# Altium project Pong.PrjPcb (part 1 of 2)
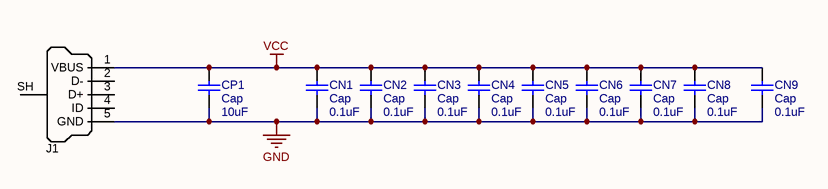
[diagram p0: POWER.SchDoc]
17 sheets, 105 parts. Net scope: flat (ports and power ports of the same name join across sheets).
Board files: PONG.PcbDoc, PONG_2.PcbDoc, PONG_3.PcbDoc
Sheets:
  POWER.SchDoc
  CLK.SchDoc
  HSYNC.SchDoc
  VSYNC.SchDoc
  SYNC-VideoSum.SchDoc
  Paddle_1.SchDoc
  Paddle_2.SchDoc
  Net.SchDoc
  HorizBallCounter.SchDoc
  HorizBallControl.SchDoc
  VertBallCounter.SchDoc
  VertBallControl.SchDoc
  ScoreCount.SchDoc
  ScoreDisplay_1.SchDoc
  ScoreDisplay_2.SchDoc
  GameControl.SchDoc
  Sound.SchDoc

## Sheet POWER.SchDoc: POWER
size A4

### Parts
CN1  Cap  value 0.1uF  [CAPR10.16-11.5x3.6]
CN2  Cap  value 0.1uF  [CAPR10.16-11.5x3.6]
CN3  Cap  value 0.1uF  [CAPR10.16-11.5x3.6]
CN4  Cap  value 0.1uF  [CAPR10.16-11.5x3.6]
CN5  Cap  value 0.1uF  [CAPR10.16-11.5x3.6]
CN6  Cap  value 0.1uF  [CAPR10.16-11.5x3.6]
CN7  Cap  value 0.1uF  [CAPR10.16-11.5x3.6]
CN8  Cap  value 0.1uF  [CAPR10.16-11.5x3.6]
CN9  Cap  value 0.1uF  [CAPR10.16-11.5x3.6]
CP1  Cap  value 10uF  [CAPE3.5mm]
J1  USB Micro Type B (recommended if hand soldering)  [USB Micro B SMD]  (value not drawn)

### Nets
GND: CN1.1 CN2.1 CN3.1 CN4.1 CN5.1 CN6.1 CN7.1 CN8.1 CN9.1 CP1.2 J1.5(GND)
VCC: CN1.2 CN2.2 CN3.2 CN4.2 CN5.2 CN6.2 CN7.2 CN8.2 CN9.2 CP1.1 J1.1(VBUS)

Not connected (* = marked no-connect by the designer): J1 2(D-) 3(D+) 4(ID) SH(Shell)

### Notes on the sheet
- Text
- Page
- PONG

### Library data of the parts
CN1-CN9 CP1 = Cap: Capacitor; Published: 8-Jun-2000; LatestRevisionDate: 17-Jul-2002; LatestRevisionNote: Re-released for DXP Platform.; PackageReference: RAD-0.3; Publisher: Altium Limited; PackageDescription: Radial Cap, Thru-Hole; 2 Leads; 0.3 in Pin Spacing
J1 = USB_Micro_TypeB_FCI: Connector SMD-THD USB Micro Type B middle mount; Manufacturer 1: FCI; Manufacturer Part Number 1: 10103593-0001LF; SCDType: undef; Package / Case: SMD/THD mid-mount; Supplier 1: Digi-Key; Supplier Part Number 1: 609-4049-1-ND

## Sheet CLK.SchDoc: CLK
size A4; SheetNumber: 1
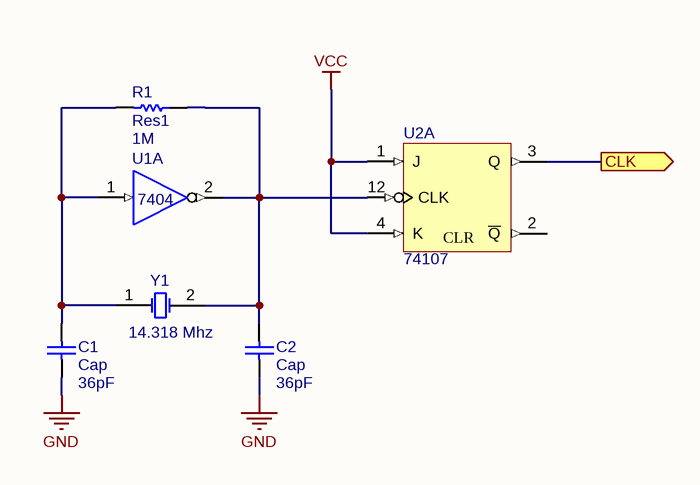
[diagram p1: CLK.SchDoc]

### Parts
C1  Cap  value 36pF  [CAPR10.16-11.5x3.6]
C2  Cap  value 36pF  [CAPR10.16-11.5x3.6]
R1  Res1  value 1M  [AXIAL-0.4]
U1  7404  [N014]  (part A of 6)
U2  74107  [N014D]  (part A of 2)
Y1  14.318 Mhz  [HC-49U]

### Ports
CLK

### Nets
GND: C1.1 C2.1 U1.7(GND) U2.7(GND)
VCC: U1.14(VCC) U2.1(J) U2.4(K) U2.13(CLR) U2.14(VCC)
CLK: U2.3(Q) ; port CLK
NetC1_2: C1.2 R1.2 U1.1(A) Y1.1(OSC1)
NetC2_2: C2.2 R1.1 U1.2(Y) U2.12(CLK) Y1.2(OSC2)

Not connected (* = marked no-connect by the designer): U2 2(~{Q})

### Notes on the sheet
- Text
- Page
- PONG

### Library data of the parts
C1 C2 = Cap: Capacitor; Published: 8-Jun-2000; LatestRevisionDate: 17-Jul-2002; LatestRevisionNote: Re-released for DXP Platform.; PackageReference: RAD-0.3; Publisher: Altium Limited; PackageDescription: Radial Cap, Thru-Hole; 2 Leads; 0.3 in Pin Spacing
R1 = Res1: Resistor; Published: 8-Jun-2000; LatestRevisionDate: 17-Jul-2002; LatestRevisionNote: Re-released for DXP Platform.; PackageReference: AXIAL-0.3; Publisher: Altium Limited; PackageDescription: Axial Device, Thru-Hole; 2 Leads; 0.3 in Pin Spacing
U1 = SN74LS04N: Hex Inverter; Published: 8-Jun-2000; LatestRevisionDate: 04-Mar-2005; LatestRevisionNote: Stylized 3D Model Added.; DatasheetVersion: Mar-1988; PackageVersion: Oct-1995; PackageReference: N014; Publisher: Altium Limited; PackageDescription: DIP; 14 Leads; Row Spacing 7.62 mm; Pitch 2.54 mm; ComponentLink1Description: Manufacturer Link; ComponentLink1URL: http://www.ti.com/; ComponentLink2Description: Datasheet; ComponentLink2URL: http://www-s.ti.com/sc/ds/sn74ls04.pdf
U2 = SN74HC107N: Dual J-K Negative-Edge-Triggered Flip-Flop with Clear; Published: 8-Jun-2000; LatestRevisionDate: 04-Mar-2005; LatestRevisionNote: Stylized 3D Model Added.; DatasheetVersion: Jun-1989; PackageVersion: Oct-1995; PackageReference: N014D; Publisher: Altium Limited; PackageDescription: DIP; 14 Leads; Row Spacing 7.62 mm; Pitch 2.54 mm; ComponentLink1Description: Manufacturer Link; ComponentLink1URL: http://www.ti.com/
Y1 = XTAL: Crystal Oscillator; Published: 8-Jun-2000; LatestRevisionDate: 17-Jul-2002; LatestRevisionNote: Re-released for DXP Platform.; PackageReference: R38; Publisher: Altium Limited; PackageDescription: Crystal, Thru-Hole; 2 Leads; Body 3.1 x 8.2 mm (Dia.xH)

## Sheet HSYNC.SchDoc: HSYNC
size A4; SheetNumber: 2
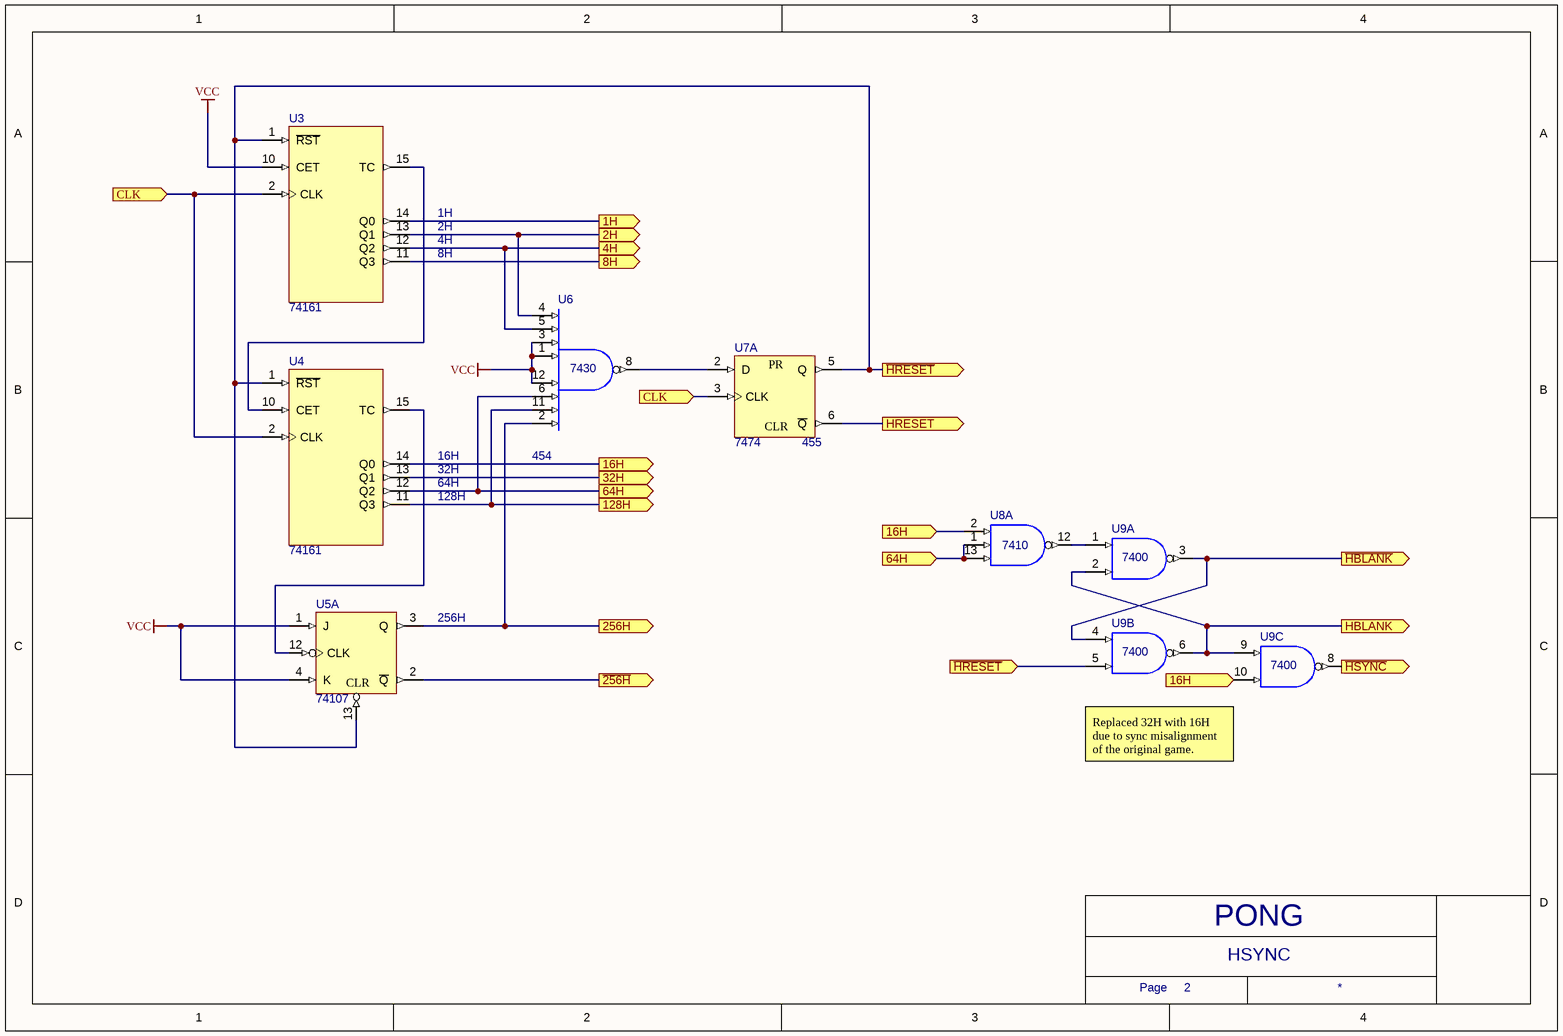
[diagram p2: HSYNC.SchDoc]

### Parts
U3  74161  [N016]
U4  74161  [N016]
U5  74107  [N014]  (part A of 2)
U6  7430  [N014]
U7  7474  [N014D]  (part A of 2)
U8  7410  [N014]  (part A of 3)
U9  7400  [N014]  (parts A,B,C of 4)

### Ports
1H, 2H, 4H, 8H, 16H, 32H, 64H, 128H, 256H, CLK, HBLANK, HRESET, ~{256H}, ~{HBLANK}, ~{HRESET}, ~{HSYNC}

### Nets
GND: U3.8(GND) U4.8(GND) U5.7(GND) U6.7(GND) U7.7(GND) U8.7(GND) U9.7(GND)
VCC: U3.3(P0) U3.4(P1) U3.5(P2) U3.6(P3) U3.7(CEP) U3.9(~{PE}) U3.10(CET) U3.16(VCC) U4.3(P0) U4.4(P1) U4.5(P2) U4.6(P3) U4.7(CEP) U4.9(~{PE}) U4.16(VCC) U5.1(J) U5.4(K) U5.14(VCC) U6.1(A) U6.3(C) U6.12(H) U6.14(VCC) U7.1(CLR) U7.4(PR) U7.14(VCC) U8.14(VCC) U9.14(VCC)
1H: U3.14(Q0) ; port 1H
2H: U3.13(Q1) U6.4(D) ; port 2H
4H: U3.12(Q2) U6.5(E) ; port 4H
8H: U3.11(Q3) ; port 8H
16H: U4.14(Q0) U8.2(B) U9.10(B) ; port 16H
32H: U4.13(Q1) ; port 32H
64H: U4.12(Q2) U6.6(F) U8.1(A) U8.13(C) ; port 64H
128H: U4.11(Q3) U6.11(G) ; port 128H
256H: U5.3(Q) U6.2(B) ; port 256H
~{256H}: U5.2(~{Q}) ; port ~{256H}
~{HBLANK}: U9.3(Y) U9.4(A) ; port ~{HBLANK}
~{HRESET}: U3.1(~{RST}) U4.1(~{RST}) U5.13(CLR) U7.5(Q) U9.5(B) ; port ~{HRESET}
~{HSYNC}: U9.8(Y) ; port ~{HSYNC}
CLK: U3.2(CLK) U4.2(CLK) U7.3(CLK) ; port CLK
HBLANK: U9.2(B) U9.6(Y) U9.9(A) ; port HBLANK
HRESET: U7.6(~{Q}) ; port HRESET
NetU3_15: U3.15(TC) U4.10(CET)
NetU4_15: U4.15(TC) U5.12(CLK)
NetU6_8: U6.8(Y) U7.2(D)
NetU8_12: U8.12(Y) U9.1(A)

### Notes on the sheet
- 1H
- 2H
- 4H
- 8H
- (near U7) 455
- 16H
- 32H
- 64H
- 128H
- (near U6) 454
- (near U5) 256H
- (near U9) Replaced 32H with 16H due to sync misalignment of the original game.
- Text
- Page
- PONG

### Library data of the parts
U3 U4 = SN74LS161AN: Synchronous 4-Bit Counter; Published: 8-Jun-2000; LatestRevisionDate: 04-Mar-2005; LatestRevisionNote: Stylized 3D Model Added.; DatasheetVersion: Mar-1988; PackageVersion: Oct-1995; PackageReference: N016; Publisher: Altium Limited; PackageDescription: DIP; 16 Leads; Row Spacing 7.62 mm; Pitch 2.54 mm; Code_JEDEC: MS-001-BB; ComponentLink1Description: Manufacturer Link; ComponentLink1URL: http://www.ti.com/; ComponentLink2Description: Datasheet; ComponentLink2URL: http://www-s.ti.com/sc/ds/sn74ls161a.pdf; ComponentLink3Description: URL Link1; ComponentLink3URL: http://focus.ti.com/docs/prod/folders/print/sn74ls161a.html
U5 = SN74LS107AN: Dual J-K Flip-Flop with Clear; Published: 8-Jun-2000; LatestRevisionDate: 04-Mar-2005; LatestRevisionNote: Stylized 3D Model Added.; DatasheetVersion: Mar-1988; PackageVersion: Oct-1995; PackageReference: N014; Publisher: Altium Limited; PackageDescription: DIP; 14 Leads; Row Spacing 7.62 mm; Pitch 2.54 mm; ComponentLink1Description: Manufacturer Link; ComponentLink1URL: http://www.ti.com/; ComponentLink2Description: Datasheet; ComponentLink2URL: http://www-s.ti.com/sc/ds/sn74ls107a.pdf
U6 = SN74LS30N: 8-Input Positive-NAND Gate; Note: Pins 9, 10  and 13 are NC & not drawn.; Published: 8-Jun-2000; LatestRevisionDate: 04-Mar-2005; LatestRevisionNote: Stylized 3D Model Added.; DatasheetVersion: Mar-1988; PackageVersion: Oct-1995; PackageReference: N014; Publisher: Altium Limited; PackageDescription: DIP; 14 Leads; Row Spacing 7.62 mm; Pitch 2.54 mm; ComponentLink1Description: Manufacturer Link; ComponentLink1URL: http://www.ti.com/; ComponentLink2Description: Datasheet; ComponentLink2URL: http://www-s.ti.com/sc/ds/sn74s30.pdf
U7 = SN74LS74AN: Dual D-Type Positive-Edge-Triggered Flip-Flop with Preset and Clear; Published: 8-Jun-2000; LatestRevisionDate: 04-Mar-2005; LatestRevisionNote: Stylized 3D Model Added.; DatasheetVersion: Mar-1988; PackageVersion: Oct-1995; PackageReference: N014D; Publisher: Altium Limited; PackageDescription: DIP; 14 Leads; Row Spacing 7.62 mm; Pitch 2.54 mm; ComponentLink1Description: Manufacturer Link; ComponentLink1URL: http://www.ti.com/; ComponentLink2Description: Datasheet; ComponentLink2URL: http://www-s.ti.com/sc/ds/sn74ls74a.pdf
U8 = SN74LS10N: Triple 3-Input Positive-NAND Gate; Published: 8-Jun-2000; LatestRevisionDate: 04-Mar-2005; LatestRevisionNote: Stylized 3D Model Added.; DatasheetVersion: Mar-1988; PackageVersion: Oct-1995; PackageReference: N014; Publisher: Altium Limited; PackageDescription: DIP; 14 Leads; Row Spacing 7.62 mm; Pitch 2.54 mm; ComponentLink1Description: Manufacturer Link; ComponentLink1URL: http://www.ti.com/; ComponentLink2Description: Datasheet; ComponentLink2URL: http://www-s.ti.com/sc/ds/sn74ls10.pdf
U9 = SN74LS00N: Quadruple 2-Input Positive-NAND Gate; Published: 8-Jun-2000; LatestRevisionDate: 04-Mar-2005; LatestRevisionNote: Stylized 3D Model Added.; DatasheetVersion: Mar-1988; PackageVersion: Oct-1995; PackageReference: N014; Publisher: Altium Limited; PackageDescription: DIP; 14 Leads; Row Spacing 7.62 mm; Pitch 2.54 mm; ComponentLink1Description: Manufacturer Link; ComponentLink1URL: http://www.ti.com/; ComponentLink2Description: Datasheet; ComponentLink2URL: http://www-s.ti.com/sc/ds/sn74ls00.pdf

## Sheet VSYNC.SchDoc: VSYNC
size A4; SheetNumber: 3
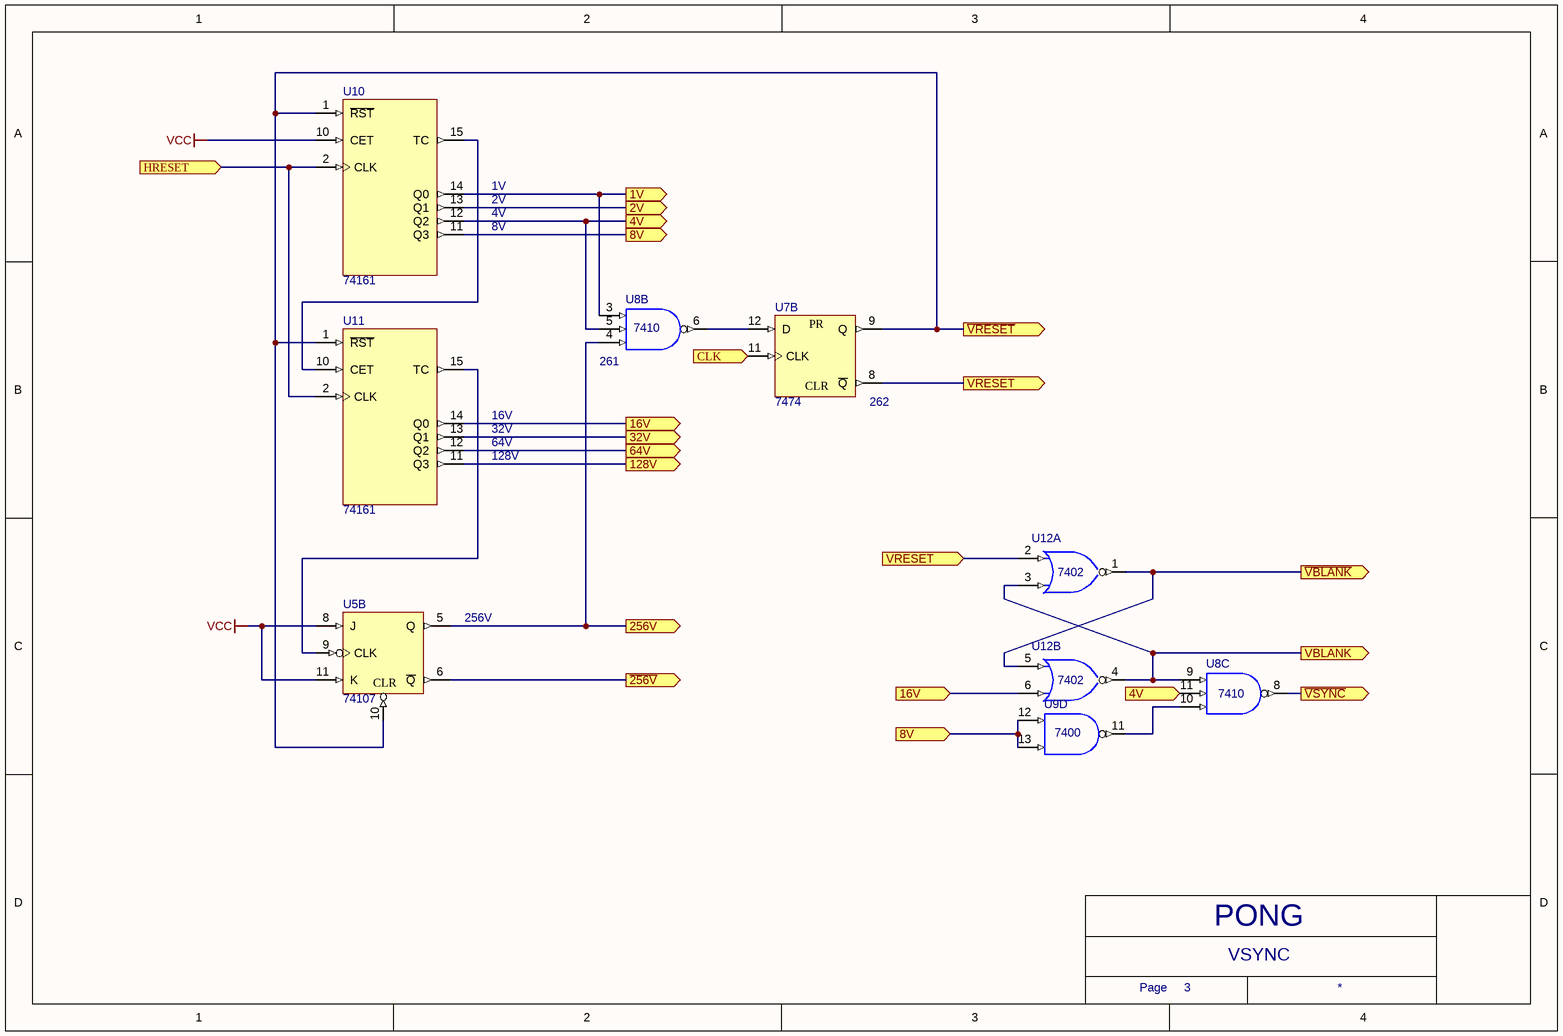
[diagram p3: VSYNC.SchDoc]

### Parts
U5  74107  [N014]  (part B of 2)
U7  7474  [N014D]  (part B of 2)
U8  7410  [N014]  (parts B,C of 3)
U9  7400  [N014]  (part D of 4)
U10  74161  [N016]
U11  74161  [N016]
U12  7402  [N014]  (parts A,B of 4)

### Ports
1V, 2V, 4V, 8V, 16V, 32V, 64V, 128V, 256V, CLK, HRESET, VBLANK, VRESET, ~{256V}, ~{VBLANK}, ~{VRESET}, ~{VSYNC}

### Nets
GND: U5.7(GND) U7.7(GND) U8.7(GND) U9.7(GND) U10.8(GND) U11.8(GND) U12.7(GND)
VCC: U5.8(J) U5.11(K) U5.14(VCC) U7.10(PR) U7.13(CLR) U7.14(VCC) U8.14(VCC) U9.14(VCC) U10.3(P0) U10.4(P1) U10.5(P2) U10.6(P3) U10.7(CEP) U10.9(~{PE}) U10.10(CET) U10.16(VCC) U11.3(P0) U11.4(P1) U11.5(P2) U11.6(P3) U11.7(CEP) U11.9(~{PE}) U11.16(VCC) U12.14(VCC)
1V: U8.3(A) U10.14(Q0) ; port 1V
2V: U10.13(Q1) ; port 2V
4V: U8.5(C) U8.11(C) U10.12(Q2) ; port 4V
8V: U9.12(A) U9.13(B) U10.11(Q3) ; port 8V
16V: U11.14(Q0) U12.6(B) ; port 16V
32V: U11.13(Q1) ; port 32V
64V: U11.12(Q2) ; port 64V
128V: U11.11(Q3) ; port 128V
256V: U5.5(Q) U8.4(B) ; port 256V
~{256V}: U5.6(~{Q}) ; port ~{256V}
~{VBLANK}: U12.1(Y) U12.5(A) ; port ~{VBLANK}
~{VRESET}: U5.10(CLR) U7.9(Q) U10.1(~{RST}) U11.1(~{RST}) ; port ~{VRESET}
~{VSYNC}: U8.8(Y) ; port ~{VSYNC}
CLK: U7.11(CLK) ; port CLK
HRESET: U10.2(CLK) U11.2(CLK) ; port HRESET
VBLANK: U8.9(A) U12.3(B) U12.4(Y) ; port VBLANK
VRESET: U7.8(~{Q}) U12.2(A) ; port VRESET
NetU5_9: U5.9(CLK) U11.15(TC)
NetU7_12: U7.12(D) U8.6(Y)
NetU8_10: U8.10(B) U9.11(Y)
NetU10_15: U10.15(TC) U11.10(CET)

### Notes on the sheet
- 1V
- 2V
- 4V
- 8V
- (near U8) 261
- 16V
- 32V
- 64V
- (near U7) 262
- 128V
- (near U5) 256V
- Text
- Page
- PONG

### Library data of the parts
U5 = SN74LS107AN: Dual J-K Flip-Flop with Clear; Published: 8-Jun-2000; LatestRevisionDate: 04-Mar-2005; LatestRevisionNote: Stylized 3D Model Added.; DatasheetVersion: Mar-1988; PackageVersion: Oct-1995; PackageReference: N014; Publisher: Altium Limited; PackageDescription: DIP; 14 Leads; Row Spacing 7.62 mm; Pitch 2.54 mm; ComponentLink1Description: Manufacturer Link; ComponentLink1URL: http://www.ti.com/; ComponentLink2Description: Datasheet; ComponentLink2URL: http://www-s.ti.com/sc/ds/sn74ls107a.pdf
U7 = SN74LS74AN: as U7 on sheet HSYNC; Published: 8-Jun-2000; LatestRevisionDate: 04-Mar-2005; LatestRevisionNote: Stylized 3D Model Added.; DatasheetVersion: Mar-1988; PackageVersion: Oct-1995; PackageReference: N014D; Publisher: Altium Limited; PackageDescription: DIP; 14 Leads; Row Spacing 7.62 mm; Pitch 2.54 mm; ComponentLink1Description: Manufacturer Link; ComponentLink1URL: http://www.ti.com/; ComponentLink2Description: Datasheet; ComponentLink2URL: http://www-s.ti.com/sc/ds/sn74ls74a.pdf
U8 = SN74LS10N: Triple 3-Input Positive-NAND Gate; Published: 8-Jun-2000; LatestRevisionDate: 04-Mar-2005; LatestRevisionNote: Stylized 3D Model Added.; DatasheetVersion: Mar-1988; PackageVersion: Oct-1995; PackageReference: N014; Publisher: Altium Limited; PackageDescription: DIP; 14 Leads; Row Spacing 7.62 mm; Pitch 2.54 mm; ComponentLink1Description: Manufacturer Link; ComponentLink1URL: http://www.ti.com/; ComponentLink2Description: Datasheet; ComponentLink2URL: http://www-s.ti.com/sc/ds/sn74ls10.pdf
U9 = SN74LS00N: Quadruple 2-Input Positive-NAND Gate; Published: 8-Jun-2000; LatestRevisionDate: 04-Mar-2005; LatestRevisionNote: Stylized 3D Model Added.; DatasheetVersion: Mar-1988; PackageVersion: Oct-1995; PackageReference: N014; Publisher: Altium Limited; PackageDescription: DIP; 14 Leads; Row Spacing 7.62 mm; Pitch 2.54 mm; ComponentLink1Description: Manufacturer Link; ComponentLink1URL: http://www.ti.com/; ComponentLink2Description: Datasheet; ComponentLink2URL: http://www-s.ti.com/sc/ds/sn74ls00.pdf
U10 U11 = SN74LS161AN: Synchronous 4-Bit Counter; Published: 8-Jun-2000; LatestRevisionDate: 04-Mar-2005; LatestRevisionNote: Stylized 3D Model Added.; DatasheetVersion: Mar-1988; PackageVersion: Oct-1995; PackageReference: N016; Publisher: Altium Limited; PackageDescription: DIP; 16 Leads; Row Spacing 7.62 mm; Pitch 2.54 mm; Code_JEDEC: MS-001-BB; ComponentLink1Description: Manufacturer Link; ComponentLink1URL: http://www.ti.com/; ComponentLink2Description: Datasheet; ComponentLink2URL: http://www-s.ti.com/sc/ds/sn74ls161a.pdf; ComponentLink3Description: URL Link1; ComponentLink3URL: http://focus.ti.com/docs/prod/folders/print/sn74ls161a.html
U12 = SN74LS02N: Quadruple 2-Input Positive-NOR Gate; Published: 8-Jun-2000; LatestRevisionDate: 04-Mar-2005; LatestRevisionNote: Stylized 3D Model Added.; DatasheetVersion: Mar-1988; PackageVersion: Oct-1995; PackageReference: N014; Publisher: Altium Limited; PackageDescription: DIP; 14 Leads; Row Spacing 7.62 mm; Pitch 2.54 mm; ComponentLink1Description: Manufacturer Link; ComponentLink1URL: http://www.ti.com/; ComponentLink2Description: Datasheet; ComponentLink2URL: http://www-s.ti.com/sc/ds/sn54s02.pdf

## Sheet SYNC-VideoSum.SchDoc: SYNC/Video Sum
size A4
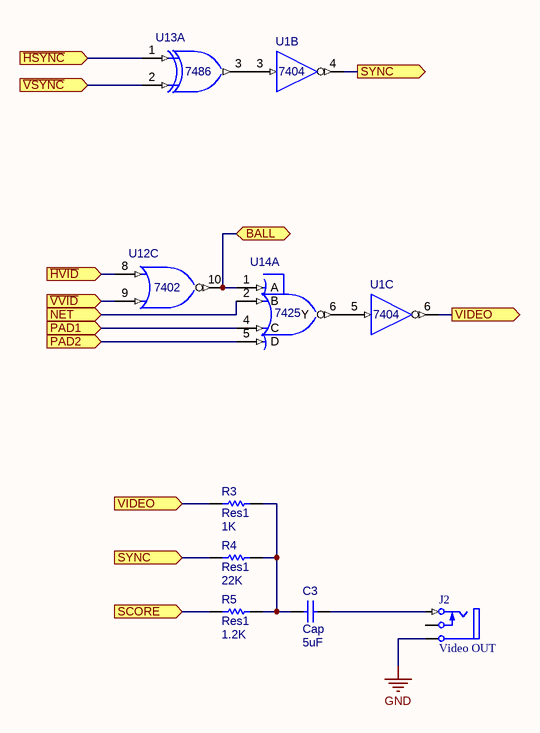
[diagram p4: SYNC-VideoSum.SchDoc]

### Parts
C3  Cap  value 5uF  [CAPR10.16-11.5x3.6]
J2  Video OUT  [RCA 2]
R3  Res1  value 1K  [AXIAL-0.4]
R4  Res1  value 22K  [AXIAL-0.4]
R5  Res1  value 1.2K  [AXIAL-0.4]
U1  7404  [N014]  (parts B,C of 6)
U12  7402  [N014]  (part C of 4)
U13  7486  [N014]  (part A of 4)
U14  7425  [N014]  (part A of 2)

### Ports
BALL, NET, PAD1, PAD2, SCORE, SYNC, VIDEO, ~{HSYNC}, ~{HVID}, ~{VSYNC}, ~{VVID}

### Nets
GND: J2.1(S) U1.7(GND) U12.7(GND) U13.7(GND) U14.7(GND)
VCC: U1.14(VCC) U12.14(VCC) U13.14(VCC) U14.3(G) U14.14(VCC)
~{HSYNC}: U13.1(A) ; port ~{HSYNC}
~{HVID}: U12.8(A) ; port ~{HVID}
~{VSYNC}: U13.2(B) ; port ~{VSYNC}
~{VVID}: U12.9(B) ; port ~{VVID}
BALL: U12.10(Y) U14.1(A) ; port BALL
NET: U14.2(B) ; port NET
PAD1: U14.4(C) ; port PAD1
PAD2: U14.5(D) ; port PAD2
SCORE: R5.1 ; port SCORE
SYNC: R4.1 U1.4(Y) ; port SYNC
VIDEO: R3.1 U1.6(Y) ; port VIDEO
NetC3_1: C3.1 R3.2 R4.2 R5.2
NetC3_2: C3.2 J2.2(T)
NetU1_3: U1.3(A) U13.3(Y)
NetU1_5: U1.5(A) U14.6(Y)

Not connected (* = marked no-connect by the designer): J2 3(TN)

### Notes on the sheet
- Text
- Page
- PONG

### Library data of the parts
C3 = Cap: Capacitor; Published: 8-Jun-2000; LatestRevisionDate: 17-Jul-2002; LatestRevisionNote: Re-released for DXP Platform.; PackageReference: RAD-0.3; Publisher: Altium Limited; PackageDescription: Radial Cap, Thru-Hole; 2 Leads; 0.3 in Pin Spacing
J2 = Phonejack2 TN: Jack Socket, 1/4" [6.5mm], Thru-Hole, Vertical, 2-Conductor with Tip closed; PackageDocument: 2003; PCB_Layout: Complies with manufacturer's recommendation.; DrillAndSlotSize: Corresponds to nominal value.; LatestRevisionDate: 15-Jul-2004; LatestRevisionNote: Component Replaced & renamed from "Phonejack".; DatasheetDocument: 2003; PackageReference: S1VS_SNB; Publisher: Altium Limited; ComponentLink1Description: Manufacturer Link; ComponentLink1URL: http://www.cliffuk.co.uk/
R3-R5 = Res1: Resistor; Published: 8-Jun-2000; LatestRevisionDate: 17-Jul-2002; LatestRevisionNote: Re-released for DXP Platform.; PackageReference: AXIAL-0.3; Publisher: Altium Limited; PackageDescription: Axial Device, Thru-Hole; 2 Leads; 0.3 in Pin Spacing
U1 = SN74LS04N: Hex Inverter; Published: 8-Jun-2000; LatestRevisionDate: 04-Mar-2005; LatestRevisionNote: Stylized 3D Model Added.; DatasheetVersion: Mar-1988; PackageVersion: Oct-1995; PackageReference: N014; Publisher: Altium Limited; PackageDescription: DIP; 14 Leads; Row Spacing 7.62 mm; Pitch 2.54 mm; ComponentLink1Description: Manufacturer Link; ComponentLink1URL: http://www.ti.com/; ComponentLink2Description: Datasheet; ComponentLink2URL: http://www-s.ti.com/sc/ds/sn74ls04.pdf
U12 = SN74LS02N: Quadruple 2-Input Positive-NOR Gate; Published: 8-Jun-2000; LatestRevisionDate: 04-Mar-2005; LatestRevisionNote: Stylized 3D Model Added.; DatasheetVersion: Mar-1988; PackageVersion: Oct-1995; PackageReference: N014; Publisher: Altium Limited; PackageDescription: DIP; 14 Leads; Row Spacing 7.62 mm; Pitch 2.54 mm; ComponentLink1Description: Manufacturer Link; ComponentLink1URL: http://www.ti.com/; ComponentLink2Description: Datasheet; ComponentLink2URL: http://www-s.ti.com/sc/ds/sn54s02.pdf
U13 = SN74LS86AN: Quadruple 2-Input Exclusive-OR Gate; Published: 8-Jun-2000; LatestRevisionDate: 04-Mar-2005; LatestRevisionNote: Stylized 3D Model Added.; DatasheetVersion: Mar-1988; PackageVersion: Oct-1995; PackageReference: N014; Publisher: Altium Limited; PackageDescription: DIP; 14 Leads; Row Spacing 7.62 mm; Pitch 2.54 mm; ComponentLink1Description: Manufacturer Link; ComponentLink1URL: http://www.ti.com/; ComponentLink2Description: Datasheet; ComponentLink2URL: http://www-s.ti.com/sc/ds/sn74ls86a.pdf
U14 = SN7425N: Dual 4-Input NOR Gate with Strobe; Published: 8-Jun-2000; LatestRevisionDate: 04-Mar-2005; LatestRevisionNote: Stylized 3D Model Added.; DatasheetVersion: Mar-1988; PackageVersion: Oct-1995; PackageReference: N014; Publisher: Altium Limited; PackageDescription: DIP; 14 Leads; Row Spacing 7.62 mm; Pitch 2.54 mm; ComponentLink1Description: Manufacturer Link; ComponentLink1URL: http://www.ti.com/; ComponentLink2Description: Datasheet; ComponentLink2URL: http://www-s.ti.com/sc/ds/sn5425.pdf; ComponentLink3Description: Packaging Specification; ComponentLink3URL: http://focus.ti.com/lit/ml/mpdi002c/mpdi002c.pdf

## Sheet Paddle_1.SchDoc: Paddle 1
size A4
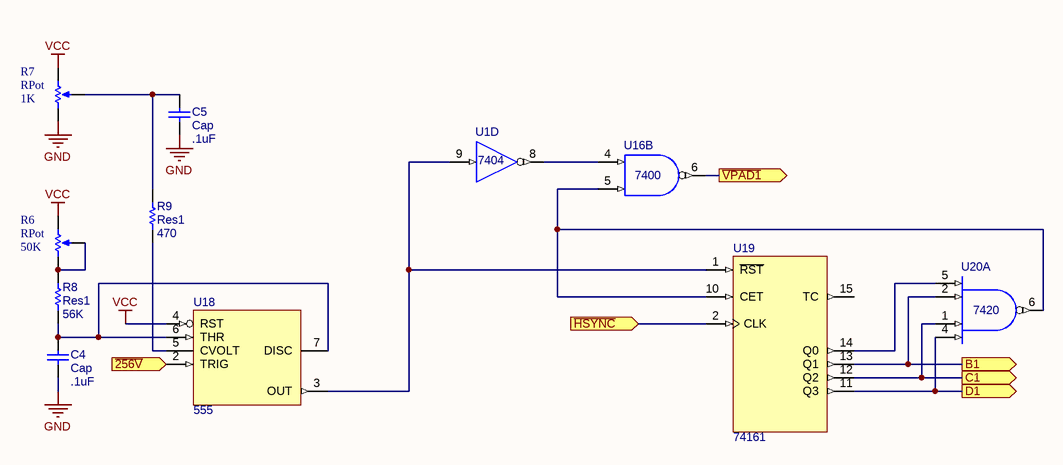
[diagram p5: Paddle_1.SchDoc]

### Parts
C4  Cap  value .1uF  [CAPR10.16-11.5x3.6]
C5  Cap  value .1uF  [CAPR10.16-11.5x3.6]
R6  RPot  value 50K  [TRIMPOT_THT_PV36X]
R7  RPot  value 1K  [VR5]
R8  Res1  value 56K  [AXIAL-0.4]
R9  Res1  value 470  [AXIAL-0.4]
U1  7404  [N014]  (part D of 6)
U16  7400  [N014]  (part B of 4)
U18  555  [P008]
U19  74161  [N016]
U20  7420  [N014]  (part A of 2)

### Ports
B1, C1, D1, ~{256V}, ~{HSYNC}, ~{VPAD1}

### Nets
GND: C4.1 C5.1 R7.1(TOP) U1.7(GND) U16.7(GND) U18.1(GND) U19.8(GND) U20.7(GND)
VCC: R6.CW(BOT) R7.2(BOT) U1.14(VCC) U16.14(VCC) U18.4(RST) U18.8(VCC) U19.3(P0) U19.4(P1) U19.5(P2) U19.6(P3) U19.7(CEP) U19.9(~{PE}) U19.16(VCC) U20.14(VCC)
~{256V}: U18.2(TRIG) ; port ~{256V}
~{HSYNC}: U19.2(CLK) ; port ~{HSYNC}
~{VPAD1}: U16.6(Y) ; port ~{VPAD1}
B1: U19.13(Q1) U20.2(B) ; port B1
C1: U19.12(Q2) U20.1(A) ; port C1
D1: U19.11(Q3) U20.4(C) ; port D1
NetC4_2: C4.2 R8.1 U18.6(THR) U18.7(DISC)
NetC5_2: C5.2 R7.3(TAP) R9.2
NetR6_CCW: R6.CCW(TOP) R6.W(TAP) R8.2
NetR9_1: R9.1 U18.5(CVOLT)
NetU1_8: U1.8(Y) U16.4(A)
NetU1_9: U1.9(A) U18.3(OUT) U19.1(~{RST})
NetU16_5: U16.5(B) U19.10(CET) U20.6(Y)
NetU19_14: U19.14(Q0) U20.5(D)

Not connected (* = marked no-connect by the designer): U19 15(TC)

### Notes on the sheet
- Text
- Page
- PONG

### Library data of the parts
C4 C5 = Cap: Capacitor; Published: 8-Jun-2000; LatestRevisionDate: 17-Jul-2002; LatestRevisionNote: Re-released for DXP Platform.; PackageReference: RAD-0.3; Publisher: Altium Limited; PackageDescription: Radial Cap, Thru-Hole; 2 Leads; 0.3 in Pin Spacing
R6 R7 = RPot: Potentiometer; Sim Note: Enter the Resistance value and the set point into parameter fields.; Set Position: 0.5; Published: 8-Jun-2000; LatestRevisionDate: 17-Jul-2002; LatestRevisionNote: Re-released for DXP Platform.; PackageReference: VR5; Publisher: Altium Limited; PackageDescription: Variable Resistor, Thru-Hole; 3 Leads
R8 R9 = Res1: Resistor; Published: 8-Jun-2000; LatestRevisionDate: 17-Jul-2002; LatestRevisionNote: Re-released for DXP Platform.; PackageReference: AXIAL-0.3; Publisher: Altium Limited; PackageDescription: Axial Device, Thru-Hole; 2 Leads; 0.3 in Pin Spacing
U1 = SN74LS04N: Hex Inverter; Published: 8-Jun-2000; LatestRevisionDate: 04-Mar-2005; LatestRevisionNote: Stylized 3D Model Added.; DatasheetVersion: Mar-1988; PackageVersion: Oct-1995; PackageReference: N014; Publisher: Altium Limited; PackageDescription: DIP; 14 Leads; Row Spacing 7.62 mm; Pitch 2.54 mm; ComponentLink1Description: Manufacturer Link; ComponentLink1URL: http://www.ti.com/; ComponentLink2Description: Datasheet; ComponentLink2URL: http://www-s.ti.com/sc/ds/sn74ls04.pdf
U16 = SN74LS00N: Quadruple 2-Input Positive-NAND Gate; Published: 8-Jun-2000; LatestRevisionDate: 04-Mar-2005; LatestRevisionNote: Stylized 3D Model Added.; DatasheetVersion: Mar-1988; PackageVersion: Oct-1995; PackageReference: N014; Publisher: Altium Limited; PackageDescription: DIP; 14 Leads; Row Spacing 7.62 mm; Pitch 2.54 mm; ComponentLink1Description: Manufacturer Link; ComponentLink1URL: http://www.ti.com/; ComponentLink2Description: Datasheet; ComponentLink2URL: http://www-s.ti.com/sc/ds/sn74ls00.pdf
U18 = NE555P: Precision Timer; Published: 16-Jan-2001; LatestRevisionDate: 04-Mar-2005; LatestRevisionNote: Stylized 3D Model Added.; DatasheetVersion: Feb-1992; PackageVersion: Jun-1999; PackageReference: P008; Publisher: Altium Limited; PackageDescription: DIP; 8 Leads; Row Spacing 7.62 mm; Pitch 2.54 mm; Code_JEDEC: MO-001-AN; ComponentLink1Description: Manufacturer Link; ComponentLink1URL: http://www.ti.com/; ComponentLink2Description: Datasheet; ComponentLink2URL: http://www-s.ti.com/sc/ds/ne555.pdf
U19 = SN74LS161AN: Synchronous 4-Bit Counter; Published: 8-Jun-2000; LatestRevisionDate: 04-Mar-2005; LatestRevisionNote: Stylized 3D Model Added.; DatasheetVersion: Mar-1988; PackageVersion: Oct-1995; PackageReference: N016; Publisher: Altium Limited; PackageDescription: DIP; 16 Leads; Row Spacing 7.62 mm; Pitch 2.54 mm; Code_JEDEC: MS-001-BB; ComponentLink1Description: Manufacturer Link; ComponentLink1URL: http://www.ti.com/; ComponentLink2Description: Datasheet; ComponentLink2URL: http://www-s.ti.com/sc/ds/sn74ls161a.pdf; ComponentLink3Description: URL Link1; ComponentLink3URL: http://focus.ti.com/docs/prod/folders/print/sn74ls161a.html
U20 = SN74LS20N: Dual 4-Input Positive-NAND Gate; Note: Pins 3 and 11 are NC & not drawn.; Published: 8-Jun-2000; LatestRevisionDate: 04-Mar-2005; LatestRevisionNote: Stylized 3D Model Added.; DatasheetVersion: Mar-1988; PackageVersion: Oct-1995; PackageReference: N014; Publisher: Altium Limited; PackageDescription: DIP; 14 Leads; Row Spacing 7.62 mm; Pitch 2.54 mm; ComponentLink1Description: Manufacturer Link; ComponentLink1URL: http://www.ti.com/; ComponentLink2Description: Datasheet; ComponentLink2URL: http://www-s.ti.com/sc/ds/sn74ls20.pdf

## Sheet Paddle_2.SchDoc: Paddle 2
size A4
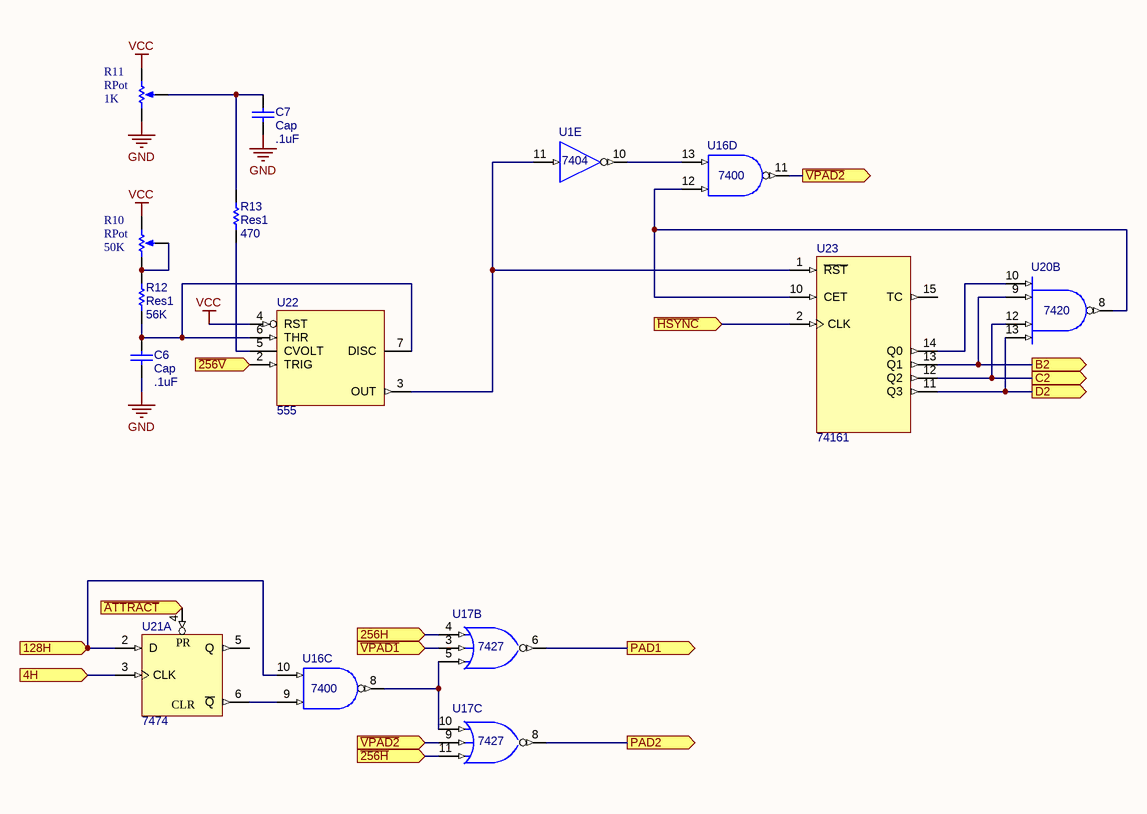
[diagram p6: Paddle_2.SchDoc]

### Parts
C6  Cap  value .1uF  [CAPR10.16-11.5x3.6]
C7  Cap  value .1uF  [CAPR10.16-11.5x3.6]
R10  RPot  value 50K  [TRIMPOT_THT_PV36X]
R11  RPot  value 1K  [VR5]
R12  Res1  value 56K  [AXIAL-0.4]
R13  Res1  value 470  [AXIAL-0.4]
U1  7404  [N014]  (part E of 6)
U16  7400  [N014]  (parts C,D of 4)
U17  7427  [N014]  (parts B,C of 3)
U20  7420  [N014]  (part B of 2)
U21  7474  [N014D]  (part A of 2)
U22  555  [P008]
U23  74161  [N016]

### Ports
4H, 128H, 256H, B2, C2, D2, PAD1, PAD2, ~{256H}, ~{256V}, ~{ATTRACT}, ~{HSYNC}, ~{VPAD1}, ~{VPAD2}

### Nets
GND: C6.1 C7.1 R11.1(TOP) U1.7(GND) U16.7(GND) U17.7(GND) U20.7(GND) U21.7(GND) U22.1(GND) U23.8(GND)
VCC: R10.CW(BOT) R11.2(BOT) U1.14(VCC) U16.14(VCC) U17.14(VCC) U20.14(VCC) U21.1(CLR) U21.14(VCC) U22.4(RST) U22.8(VCC) U23.3(P0) U23.4(P1) U23.5(P2) U23.6(P3) U23.7(CEP) U23.9(~{PE}) U23.16(VCC)
4H: U21.3(CLK) ; port 4H
128H: U16.10(B) U21.2(D) ; port 128H
256H: U17.4(B) ; port 256H
~{256H}: U17.11(C) ; port ~{256H}
~{256V}: U22.2(TRIG) ; port ~{256V}
~{ATTRACT}: U21.4(PR) ; port ~{ATTRACT}
~{HSYNC}: U23.2(CLK) ; port ~{HSYNC}
~{VPAD1}: U17.3(A) ; port ~{VPAD1}
~{VPAD2}: U16.11(Y) U17.9(A) ; port ~{VPAD2}
B2: U20.9(A) U23.13(Q1) ; port B2
C2: U20.12(C) U23.12(Q2) ; port C2
D2: U20.13(D) U23.11(Q3) ; port D2
PAD1: U17.6(Y) ; port PAD1
PAD2: U17.8(Y) ; port PAD2
NetC6_2: C6.2 R12.1 U22.6(THR) U22.7(DISC)
NetC7_2: C7.2 R11.3(TAP) R13.2
NetR10_CCW: R10.CCW(TOP) R10.W(TAP) R12.2
NetR13_1: R13.1 U22.5(CVOLT)
NetU1_10: U1.10(Y) U16.13(B)
NetU1_11: U1.11(A) U22.3(OUT) U23.1(~{RST})
NetU16_8: U16.8(Y) U17.5(C) U17.10(B)
NetU16_9: U16.9(A) U21.6(~{Q})
NetU16_12: U16.12(A) U20.8(Y) U23.10(CET)
NetU20_10: U20.10(B) U23.14(Q0)

Not connected (* = marked no-connect by the designer): U21 5(Q); U23 15(TC)

### Notes on the sheet
- Text
- Page
- PONG

### Library data of the parts
C6 C7 = Cap: Capacitor; Published: 8-Jun-2000; LatestRevisionDate: 17-Jul-2002; LatestRevisionNote: Re-released for DXP Platform.; PackageReference: RAD-0.3; Publisher: Altium Limited; PackageDescription: Radial Cap, Thru-Hole; 2 Leads; 0.3 in Pin Spacing
R10 R11 = RPot: as R6 on sheet Paddle_1; Published: 8-Jun-2000; LatestRevisionDate: 17-Jul-2002; LatestRevisionNote: Re-released for DXP Platform.; PackageReference: VR5; Publisher: Altium Limited; PackageDescription: Variable Resistor, Thru-Hole; 3 Leads
R12 R13 = Res1: Resistor; Published: 8-Jun-2000; LatestRevisionDate: 17-Jul-2002; LatestRevisionNote: Re-released for DXP Platform.; PackageReference: AXIAL-0.3; Publisher: Altium Limited; PackageDescription: Axial Device, Thru-Hole; 2 Leads; 0.3 in Pin Spacing
U1 = SN74LS04N: Hex Inverter; Published: 8-Jun-2000; LatestRevisionDate: 04-Mar-2005; LatestRevisionNote: Stylized 3D Model Added.; DatasheetVersion: Mar-1988; PackageVersion: Oct-1995; PackageReference: N014; Publisher: Altium Limited; PackageDescription: DIP; 14 Leads; Row Spacing 7.62 mm; Pitch 2.54 mm; ComponentLink1Description: Manufacturer Link; ComponentLink1URL: http://www.ti.com/; ComponentLink2Description: Datasheet; ComponentLink2URL: http://www-s.ti.com/sc/ds/sn74ls04.pdf
U16 = SN74LS00N: Quadruple 2-Input Positive-NAND Gate; Published: 8-Jun-2000; LatestRevisionDate: 04-Mar-2005; LatestRevisionNote: Stylized 3D Model Added.; DatasheetVersion: Mar-1988; PackageVersion: Oct-1995; PackageReference: N014; Publisher: Altium Limited; PackageDescription: DIP; 14 Leads; Row Spacing 7.62 mm; Pitch 2.54 mm; ComponentLink1Description: Manufacturer Link; ComponentLink1URL: http://www.ti.com/; ComponentLink2Description: Datasheet; ComponentLink2URL: http://www-s.ti.com/sc/ds/sn74ls00.pdf
U17 = SN74LS27N: Triple 3-Input Positive-NOR Gate; Published: 8-Jun-2000; LatestRevisionDate: 04-Mar-2005; LatestRevisionNote: Stylized 3D Model Added.; DatasheetVersion: Mar-1988; PackageVersion: Oct-1995; PackageReference: N014; Publisher: Altium Limited; PackageDescription: DIP; 14 Leads; Row Spacing 7.62 mm; Pitch 2.54 mm; ComponentLink1Description: Manufacturer Link; ComponentLink1URL: http://www.ti.com/; ComponentLink2Description: Datasheet; ComponentLink2URL: http://www-s.ti.com/sc/ds/sn74ls27.pdf
U20 = SN74LS20N: as U20 on sheet Paddle_1; Published: 8-Jun-2000; LatestRevisionDate: 04-Mar-2005; LatestRevisionNote: Stylized 3D Model Added.; DatasheetVersion: Mar-1988; PackageVersion: Oct-1995; PackageReference: N014; Publisher: Altium Limited; PackageDescription: DIP; 14 Leads; Row Spacing 7.62 mm; Pitch 2.54 mm; ComponentLink1Description: Manufacturer Link; ComponentLink1URL: http://www.ti.com/; ComponentLink2Description: Datasheet; ComponentLink2URL: http://www-s.ti.com/sc/ds/sn74ls20.pdf
U21 = SN74LS74AN: as U7 on sheet HSYNC; Published: 8-Jun-2000; LatestRevisionDate: 04-Mar-2005; LatestRevisionNote: Stylized 3D Model Added.; DatasheetVersion: Mar-1988; PackageVersion: Oct-1995; PackageReference: N014D; Publisher: Altium Limited; PackageDescription: DIP; 14 Leads; Row Spacing 7.62 mm; Pitch 2.54 mm; ComponentLink1Description: Manufacturer Link; ComponentLink1URL: http://www.ti.com/; ComponentLink2Description: Datasheet; ComponentLink2URL: http://www-s.ti.com/sc/ds/sn74ls74a.pdf
U22 = NE555P: Precision Timer; Published: 16-Jan-2001; LatestRevisionDate: 04-Mar-2005; LatestRevisionNote: Stylized 3D Model Added.; DatasheetVersion: Feb-1992; PackageVersion: Jun-1999; PackageReference: P008; Publisher: Altium Limited; PackageDescription: DIP; 8 Leads; Row Spacing 7.62 mm; Pitch 2.54 mm; Code_JEDEC: MO-001-AN; ComponentLink1Description: Manufacturer Link; ComponentLink1URL: http://www.ti.com/; ComponentLink2Description: Datasheet; ComponentLink2URL: http://www-s.ti.com/sc/ds/ne555.pdf
U23 = SN74LS161AN: Synchronous 4-Bit Counter; Published: 8-Jun-2000; LatestRevisionDate: 04-Mar-2005; LatestRevisionNote: Stylized 3D Model Added.; DatasheetVersion: Mar-1988; PackageVersion: Oct-1995; PackageReference: N016; Publisher: Altium Limited; PackageDescription: DIP; 16 Leads; Row Spacing 7.62 mm; Pitch 2.54 mm; Code_JEDEC: MS-001-BB; ComponentLink1Description: Manufacturer Link; ComponentLink1URL: http://www.ti.com/; ComponentLink2Description: Datasheet; ComponentLink2URL: http://www-s.ti.com/sc/ds/sn74ls161a.pdf; ComponentLink3Description: URL Link1; ComponentLink3URL: http://focus.ti.com/docs/prod/folders/print/sn74ls161a.html

## Sheet Net.SchDoc: Net
size A4
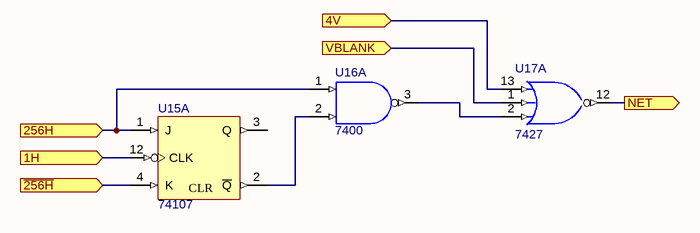
[diagram p7: Net.SchDoc]

### Parts
U15  74107  [N014]  (part A of 2)
U16  7400  [N014]  (part A of 4)
U17  7427  [N014]  (part A of 3)

### Ports
1H, 4V, 256H, NET, VBLANK, ~{256H}

### Nets
GND: U15.7(GND) U16.7(GND) U17.7(GND)
VCC: U15.13(CLR) U15.14(VCC) U16.14(VCC) U17.14(VCC)
1H: U15.12(CLK) ; port 1H
4V: U17.13(C) ; port 4V
256H: U15.1(J) U16.1(A) ; port 256H
~{256H}: U15.4(K) ; port ~{256H}
NET: U17.12(Y) ; port NET
VBLANK: U17.1(A) ; port VBLANK
NetU15_2: U15.2(~{Q}) U16.2(B)
NetU16_3: U16.3(Y) U17.2(B)

Not connected (* = marked no-connect by the designer): U15 3(Q)

### Notes on the sheet
- Text
- Page
- PONG

### Library data of the parts
U15 = SN74LS107AN: Dual J-K Flip-Flop with Clear; Published: 8-Jun-2000; LatestRevisionDate: 04-Mar-2005; LatestRevisionNote: Stylized 3D Model Added.; DatasheetVersion: Mar-1988; PackageVersion: Oct-1995; PackageReference: N014; Publisher: Altium Limited; PackageDescription: DIP; 14 Leads; Row Spacing 7.62 mm; Pitch 2.54 mm; ComponentLink1Description: Manufacturer Link; ComponentLink1URL: http://www.ti.com/; ComponentLink2Description: Datasheet; ComponentLink2URL: http://www-s.ti.com/sc/ds/sn74ls107a.pdf
U16 = SN74LS00N: Quadruple 2-Input Positive-NAND Gate; Published: 8-Jun-2000; LatestRevisionDate: 04-Mar-2005; LatestRevisionNote: Stylized 3D Model Added.; DatasheetVersion: Mar-1988; PackageVersion: Oct-1995; PackageReference: N014; Publisher: Altium Limited; PackageDescription: DIP; 14 Leads; Row Spacing 7.62 mm; Pitch 2.54 mm; ComponentLink1Description: Manufacturer Link; ComponentLink1URL: http://www.ti.com/; ComponentLink2Description: Datasheet; ComponentLink2URL: http://www-s.ti.com/sc/ds/sn74ls00.pdf
U17 = SN74LS27N: Triple 3-Input Positive-NOR Gate; Published: 8-Jun-2000; LatestRevisionDate: 04-Mar-2005; LatestRevisionNote: Stylized 3D Model Added.; DatasheetVersion: Mar-1988; PackageVersion: Oct-1995; PackageReference: N014; Publisher: Altium Limited; PackageDescription: DIP; 14 Leads; Row Spacing 7.62 mm; Pitch 2.54 mm; ComponentLink1Description: Manufacturer Link; ComponentLink1URL: http://www.ti.com/; ComponentLink2Description: Datasheet; ComponentLink2URL: http://www-s.ti.com/sc/ds/sn74ls27.pdf

## Sheet HorizBallCounter.SchDoc: Horizontal Ball Counter
size A4; SheetNumber: 4
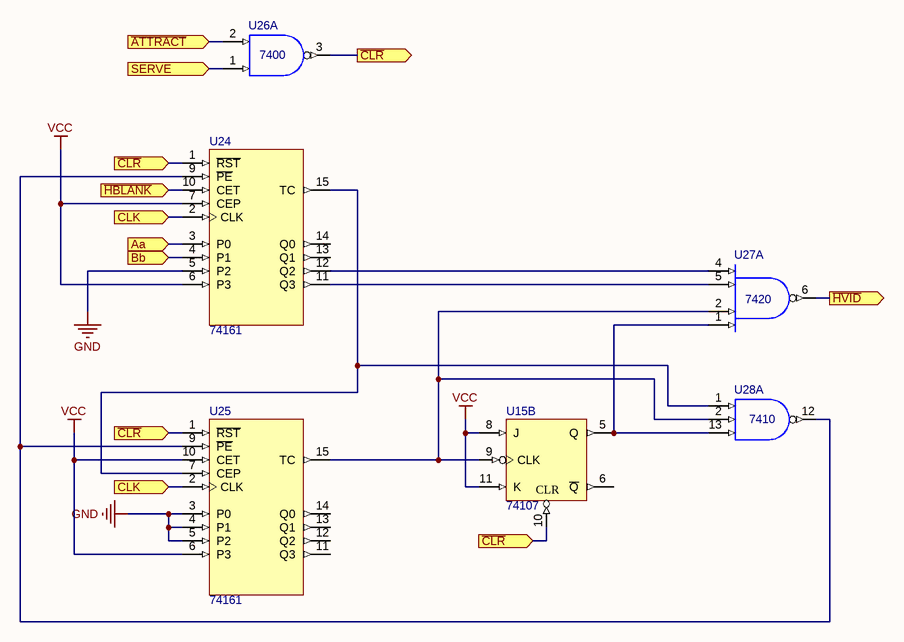
[diagram p8: HorizBallCounter.SchDoc]

### Parts
U15  74107  [N014]  (part B of 2)
U24  74161  [N016]
U25  74161  [N016]
U26  7400  [N014]  (part A of 4)
U27  7420  [N014]  (part A of 2)
U28  7410  [N014]  (part A of 3)

### Ports
Aa, Bb, CLK, SERVE, ~{ATTRACT}, ~{CLR}, ~{HBLANK}, ~{HVID}

### Nets
GND: U15.7(GND) U24.5(P2) U24.8(GND) U25.3(P0) U25.4(P1) U25.5(P2) U25.8(GND) U26.7(GND) U27.7(GND) U28.7(GND)
VCC: U15.8(J) U15.11(K) U15.14(VCC) U24.6(P3) U24.7(CEP) U24.16(VCC) U25.6(P3) U25.10(CET) U25.16(VCC) U26.14(VCC) U27.14(VCC) U28.14(VCC)
~{ATTRACT}: U26.2(B) ; port ~{ATTRACT}
~{CLR}: U15.10(CLR) U24.1(~{RST}) U25.1(~{RST}) U26.3(Y) ; port ~{CLR}
~{HBLANK}: U24.10(CET) ; port ~{HBLANK}
~{HVID}: U27.6(Y) ; port ~{HVID}
Aa: U24.3(P0) ; port Aa
Bb: U24.4(P1) ; port Bb
CLK: U24.2(CLK) U25.2(CLK) ; port CLK
SERVE: U26.1(A) ; port SERVE
NetU15_5: U15.5(Q) U27.1(A) U28.13(C)
NetU15_9: U15.9(CLK) U25.15(TC) U27.2(B) U28.2(B)
NetU24_9: U24.9(~{PE}) U25.9(~{PE}) U28.12(Y)
NetU24_11: U24.11(Q3) U27.5(D)
NetU24_12: U24.12(Q2) U27.4(C)
NetU24_15: U24.15(TC) U25.7(CEP) U28.1(A)

Not connected (* = marked no-connect by the designer): U15 6(~{Q}); U24 13(Q1) 14(Q0); U25 11(Q3) 12(Q2) 13(Q1) 14(Q0)

### Notes on the sheet
- Text
- Page
- PONG

### Library data of the parts
U15 = SN74LS107AN: Dual J-K Flip-Flop with Clear; Published: 8-Jun-2000; LatestRevisionDate: 04-Mar-2005; LatestRevisionNote: Stylized 3D Model Added.; DatasheetVersion: Mar-1988; PackageVersion: Oct-1995; PackageReference: N014; Publisher: Altium Limited; PackageDescription: DIP; 14 Leads; Row Spacing 7.62 mm; Pitch 2.54 mm; ComponentLink1Description: Manufacturer Link; ComponentLink1URL: http://www.ti.com/; ComponentLink2Description: Datasheet; ComponentLink2URL: http://www-s.ti.com/sc/ds/sn74ls107a.pdf
U24 U25 = SN74LS161AN: Synchronous 4-Bit Counter; Published: 8-Jun-2000; LatestRevisionDate: 04-Mar-2005; LatestRevisionNote: Stylized 3D Model Added.; DatasheetVersion: Mar-1988; PackageVersion: Oct-1995; PackageReference: N016; Publisher: Altium Limited; PackageDescription: DIP; 16 Leads; Row Spacing 7.62 mm; Pitch 2.54 mm; Code_JEDEC: MS-001-BB; ComponentLink1Description: Manufacturer Link; ComponentLink1URL: http://www.ti.com/; ComponentLink2Description: Datasheet; ComponentLink2URL: http://www-s.ti.com/sc/ds/sn74ls161a.pdf; ComponentLink3Description: URL Link1; ComponentLink3URL: http://focus.ti.com/docs/prod/folders/print/sn74ls161a.html
U26 = SN74LS00N: Quadruple 2-Input Positive-NAND Gate; Published: 8-Jun-2000; LatestRevisionDate: 04-Mar-2005; LatestRevisionNote: Stylized 3D Model Added.; DatasheetVersion: Mar-1988; PackageVersion: Oct-1995; PackageReference: N014; Publisher: Altium Limited; PackageDescription: DIP; 14 Leads; Row Spacing 7.62 mm; Pitch 2.54 mm; ComponentLink1Description: Manufacturer Link; ComponentLink1URL: http://www.ti.com/; ComponentLink2Description: Datasheet; ComponentLink2URL: http://www-s.ti.com/sc/ds/sn74ls00.pdf
U27 = SN74LS20N: as U20 on sheet Paddle_1; Published: 8-Jun-2000; LatestRevisionDate: 04-Mar-2005; LatestRevisionNote: Stylized 3D Model Added.; DatasheetVersion: Mar-1988; PackageVersion: Oct-1995; PackageReference: N014; Publisher: Altium Limited; PackageDescription: DIP; 14 Leads; Row Spacing 7.62 mm; Pitch 2.54 mm; ComponentLink1Description: Manufacturer Link; ComponentLink1URL: http://www.ti.com/; ComponentLink2Description: Datasheet; ComponentLink2URL: http://www-s.ti.com/sc/ds/sn74ls20.pdf
U28 = SN74LS10N: Triple 3-Input Positive-NAND Gate; Published: 8-Jun-2000; LatestRevisionDate: 04-Mar-2005; LatestRevisionNote: Stylized 3D Model Added.; DatasheetVersion: Mar-1988; PackageVersion: Oct-1995; PackageReference: N014; Publisher: Altium Limited; PackageDescription: DIP; 14 Leads; Row Spacing 7.62 mm; Pitch 2.54 mm; ComponentLink1Description: Manufacturer Link; ComponentLink1URL: http://www.ti.com/; ComponentLink2Description: Datasheet; ComponentLink2URL: http://www-s.ti.com/sc/ds/sn74ls10.pdf

## Sheet HorizBallControl.SchDoc: Horizontal Ball Control
size A4; SheetNumber: 6
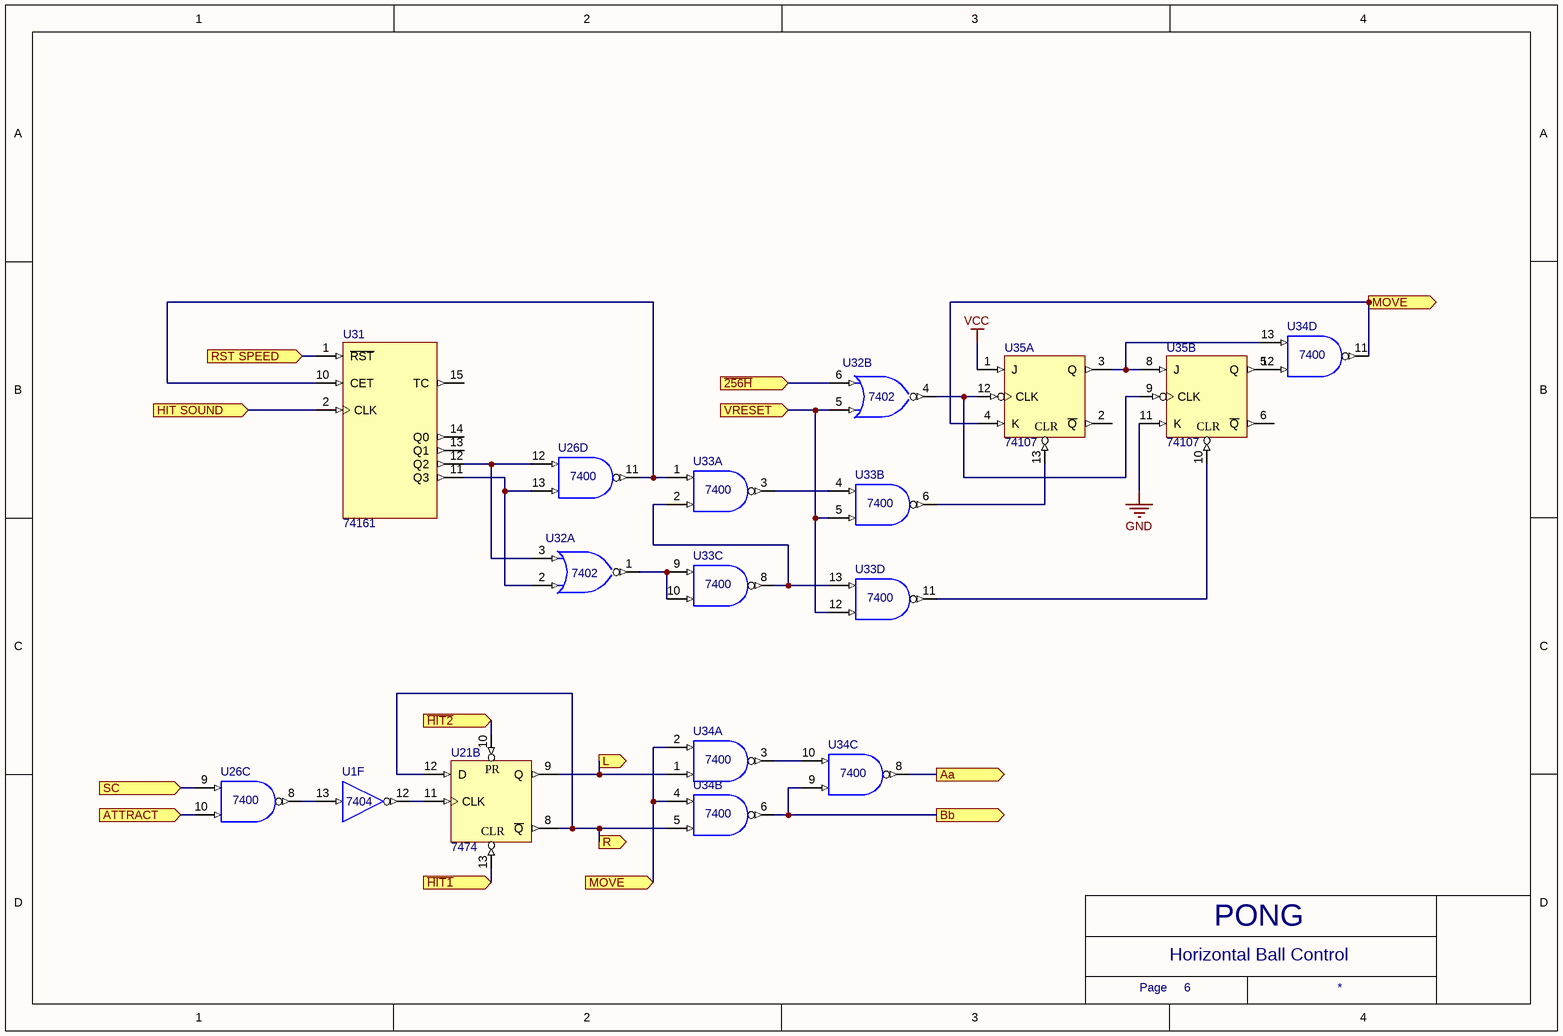
[diagram p9: HorizBallControl.SchDoc]

### Parts
U1  7404  [N014]  (part F of 6)
U21  7474  [N014D]  (part B of 2)
U26  7400  [N014]  (parts C,D of 4)
U31  74161  [N016]
U32  7402  [N014]  (parts A,B of 4)
U33  7400  [N014]  (parts A,B,C,D of 4)
U34  7400  [N014]  (parts A,B,C,D of 4)
U35  74107  [N014]  (parts A,B of 2)

### Ports
Aa, ATTRACT, Bb, HIT SOUND, L, MOVE, R, RST SPEED, SC, VRESET, ~{256H}, ~{HIT1}, ~{HIT2}

### Nets
GND: U1.7(GND) U21.7(GND) U26.7(GND) U31.8(GND) U32.7(GND) U33.7(GND) U34.7(GND) U35.7(GND) U35.11(K)
VCC: U1.14(VCC) U21.14(VCC) U26.14(VCC) U31.3(P0) U31.4(P1) U31.5(P2) U31.6(P3) U31.7(CEP) U31.9(~{PE}) U31.16(VCC) U32.14(VCC) U33.14(VCC) U34.14(VCC) U35.1(J) U35.14(VCC)
~{256H}: U32.6(B) ; port ~{256H}
~{HIT1}: U21.13(CLR) ; port ~{HIT1}
~{HIT2}: U21.10(PR) ; port ~{HIT2}
Aa: U34.8(Y) ; port Aa
ATTRACT: U26.10(B) ; port ATTRACT
Bb: U34.6(Y) U34.9(A) ; port Bb
HIT SOUND: U31.2(CLK) ; port HIT SOUND
L: U21.9(Q) U34.1(A) ; port L
MOVE: U34.2(B) U34.4(A) U34.11(Y) U35.4(K) ; port MOVE
R: U21.8(~{Q}) U21.12(D) U34.5(B) ; port R
RST SPEED: U31.1(~{RST}) ; port RST SPEED
SC: U26.9(A) ; port SC
VRESET: U32.5(A) U33.5(B) U33.12(A) ; port VRESET
NetU1_12: U1.12(Y) U21.11(CLK)
NetU1_13: U1.13(A) U26.8(Y)
NetU26_11: U26.11(Y) U31.10(CET) U33.1(A)
NetU26_12: U26.12(A) U31.12(Q2) U32.3(B)
NetU26_13: U26.13(B) U31.11(Q3) U32.2(A)
NetU32_1: U32.1(Y) U33.9(A) U33.10(B)
NetU32_4: U32.4(Y) U35.9(CLK) U35.12(CLK)
NetU33_2: U33.2(B) U33.8(Y) U33.13(B)
NetU33_3: U33.3(Y) U33.4(A)
NetU33_6: U33.6(Y) U35.13(CLR)
NetU33_11: U33.11(Y) U35.10(CLR)
NetU34_3: U34.3(Y) U34.10(B)
NetU34_12: U34.12(A) U35.5(Q)
NetU34_13: U34.13(B) U35.3(Q) U35.8(J)

Not connected (* = marked no-connect by the designer): U31 13(Q1) 14(Q0) 15(TC); U35 2(~{Q}) 6(~{Q})

### Notes on the sheet
- Text
- Page
- PONG

### Library data of the parts
U1 = SN74LS04N: Hex Inverter; Published: 8-Jun-2000; LatestRevisionDate: 04-Mar-2005; LatestRevisionNote: Stylized 3D Model Added.; DatasheetVersion: Mar-1988; PackageVersion: Oct-1995; PackageReference: N014; Publisher: Altium Limited; PackageDescription: DIP; 14 Leads; Row Spacing 7.62 mm; Pitch 2.54 mm; ComponentLink1Description: Manufacturer Link; ComponentLink1URL: http://www.ti.com/; ComponentLink2Description: Datasheet; ComponentLink2URL: http://www-s.ti.com/sc/ds/sn74ls04.pdf
U21 = SN74LS74AN: as U7 on sheet HSYNC; Published: 8-Jun-2000; LatestRevisionDate: 04-Mar-2005; LatestRevisionNote: Stylized 3D Model Added.; DatasheetVersion: Mar-1988; PackageVersion: Oct-1995; PackageReference: N014D; Publisher: Altium Limited; PackageDescription: DIP; 14 Leads; Row Spacing 7.62 mm; Pitch 2.54 mm; ComponentLink1Description: Manufacturer Link; ComponentLink1URL: http://www.ti.com/; ComponentLink2Description: Datasheet; ComponentLink2URL: http://www-s.ti.com/sc/ds/sn74ls74a.pdf
U26 U33 U34 = SN74LS00N: Quadruple 2-Input Positive-NAND Gate; Published: 8-Jun-2000; LatestRevisionDate: 04-Mar-2005; LatestRevisionNote: Stylized 3D Model Added.; DatasheetVersion: Mar-1988; PackageVersion: Oct-1995; PackageReference: N014; Publisher: Altium Limited; PackageDescription: DIP; 14 Leads; Row Spacing 7.62 mm; Pitch 2.54 mm; ComponentLink1Description: Manufacturer Link; ComponentLink1URL: http://www.ti.com/; ComponentLink2Description: Datasheet; ComponentLink2URL: http://www-s.ti.com/sc/ds/sn74ls00.pdf
U31 = SN74LS161AN: Synchronous 4-Bit Counter; Published: 8-Jun-2000; LatestRevisionDate: 04-Mar-2005; LatestRevisionNote: Stylized 3D Model Added.; DatasheetVersion: Mar-1988; PackageVersion: Oct-1995; PackageReference: N016; Publisher: Altium Limited; PackageDescription: DIP; 16 Leads; Row Spacing 7.62 mm; Pitch 2.54 mm; Code_JEDEC: MS-001-BB; ComponentLink1Description: Manufacturer Link; ComponentLink1URL: http://www.ti.com/; ComponentLink2Description: Datasheet; ComponentLink2URL: http://www-s.ti.com/sc/ds/sn74ls161a.pdf; ComponentLink3Description: URL Link1; ComponentLink3URL: http://focus.ti.com/docs/prod/folders/print/sn74ls161a.html
U32 = SN74LS02N: Quadruple 2-Input Positive-NOR Gate; Published: 8-Jun-2000; LatestRevisionDate: 04-Mar-2005; LatestRevisionNote: Stylized 3D Model Added.; DatasheetVersion: Mar-1988; PackageVersion: Oct-1995; PackageReference: N014; Publisher: Altium Limited; PackageDescription: DIP; 14 Leads; Row Spacing 7.62 mm; Pitch 2.54 mm; ComponentLink1Description: Manufacturer Link; ComponentLink1URL: http://www.ti.com/; ComponentLink2Description: Datasheet; ComponentLink2URL: http://www-s.ti.com/sc/ds/sn54s02.pdf
U35 = SN74LS107AN: Dual J-K Flip-Flop with Clear; Published: 8-Jun-2000; LatestRevisionDate: 04-Mar-2005; LatestRevisionNote: Stylized 3D Model Added.; DatasheetVersion: Mar-1988; PackageVersion: Oct-1995; PackageReference: N014; Publisher: Altium Limited; PackageDescription: DIP; 14 Leads; Row Spacing 7.62 mm; Pitch 2.54 mm; ComponentLink1Description: Manufacturer Link; ComponentLink1URL: http://www.ti.com/; ComponentLink2Description: Datasheet; ComponentLink2URL: http://www-s.ti.com/sc/ds/sn74ls107a.pdf

## Sheet VertBallCounter.SchDoc: Vertical Ball Counter
size A4; SheetNumber: 5
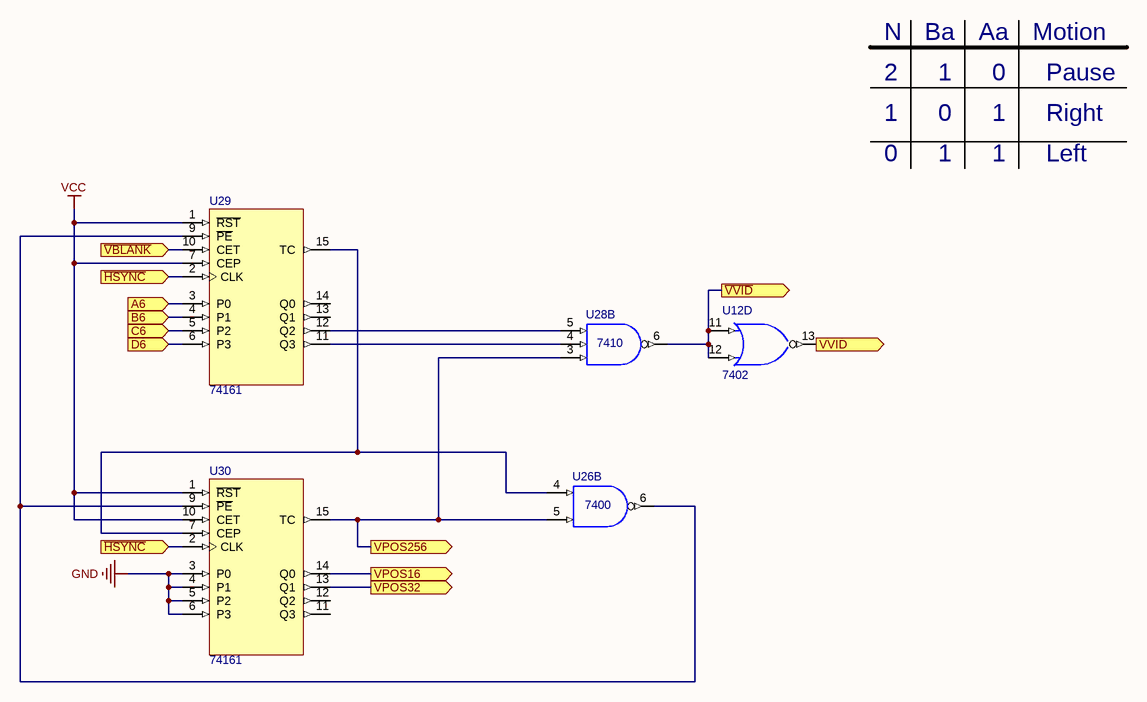
[diagram p10: VertBallCounter.SchDoc]

### Parts
U12  7402  [N014]  (part D of 4)
U26  7400  [N014]  (part B of 4)
U28  7410  [N014]  (part B of 3)
U29  74161  [N016]
U30  74161  [N016]

### Ports
A6, B6, C6, D6, VPOS16, VPOS32, VPOS256, VVID, ~{HSYNC}, ~{VBLANK}, ~{VVID}

### Nets
GND: U12.7(GND) U26.7(GND) U28.7(GND) U29.8(GND) U30.3(P0) U30.4(P1) U30.5(P2) U30.6(P3) U30.8(GND)
VCC: U12.14(VCC) U26.14(VCC) U28.14(VCC) U29.1(~{RST}) U29.7(CEP) U29.16(VCC) U30.1(~{RST}) U30.10(CET) U30.16(VCC)
~{HSYNC}: U29.2(CLK) U30.2(CLK) ; port ~{HSYNC}
~{VBLANK}: U29.10(CET) ; port ~{VBLANK}
~{VVID}: U12.11(A) U12.12(B) U28.6(Y) ; port ~{VVID}
A6: U29.3(P0) ; port A6
B6: U29.4(P1) ; port B6
C6: U29.5(P2) ; port C6
D6: U29.6(P3) ; port D6
VPOS16: U30.14(Q0) ; port VPOS16
VPOS32: U30.13(Q1) ; port VPOS32
VPOS256: U26.5(B) U28.3(A) U30.15(TC) ; port VPOS256
VVID: U12.13(Y) ; port VVID
NetU26_4: U26.4(A) U29.15(TC) U30.7(CEP)
NetU26_6: U26.6(Y) U29.9(~{PE}) U30.9(~{PE})
NetU28_4: U28.4(B) U29.11(Q3)
NetU28_5: U28.5(C) U29.12(Q2)

Not connected (* = marked no-connect by the designer): U29 13(Q1) 14(Q0); U30 11(Q3) 12(Q2)

### Notes on the sheet
- N
- 2
- Ba
- 1
- Aa
- 0
- Motion
- Pause
- Right
- Left
- Text
- Page
- PONG

### Library data of the parts
U12 = SN74LS02N: Quadruple 2-Input Positive-NOR Gate; Published: 8-Jun-2000; LatestRevisionDate: 04-Mar-2005; LatestRevisionNote: Stylized 3D Model Added.; DatasheetVersion: Mar-1988; PackageVersion: Oct-1995; PackageReference: N014; Publisher: Altium Limited; PackageDescription: DIP; 14 Leads; Row Spacing 7.62 mm; Pitch 2.54 mm; ComponentLink1Description: Manufacturer Link; ComponentLink1URL: http://www.ti.com/; ComponentLink2Description: Datasheet; ComponentLink2URL: http://www-s.ti.com/sc/ds/sn54s02.pdf
U26 = SN74LS00N: Quadruple 2-Input Positive-NAND Gate; Published: 8-Jun-2000; LatestRevisionDate: 04-Mar-2005; LatestRevisionNote: Stylized 3D Model Added.; DatasheetVersion: Mar-1988; PackageVersion: Oct-1995; PackageReference: N014; Publisher: Altium Limited; PackageDescription: DIP; 14 Leads; Row Spacing 7.62 mm; Pitch 2.54 mm; ComponentLink1Description: Manufacturer Link; ComponentLink1URL: http://www.ti.com/; ComponentLink2Description: Datasheet; ComponentLink2URL: http://www-s.ti.com/sc/ds/sn74ls00.pdf
U28 = SN74LS10N: Triple 3-Input Positive-NAND Gate; Published: 8-Jun-2000; LatestRevisionDate: 04-Mar-2005; LatestRevisionNote: Stylized 3D Model Added.; DatasheetVersion: Mar-1988; PackageVersion: Oct-1995; PackageReference: N014; Publisher: Altium Limited; PackageDescription: DIP; 14 Leads; Row Spacing 7.62 mm; Pitch 2.54 mm; ComponentLink1Description: Manufacturer Link; ComponentLink1URL: http://www.ti.com/; ComponentLink2Description: Datasheet; ComponentLink2URL: http://www-s.ti.com/sc/ds/sn74ls10.pdf
U29 U30 = SN74LS161AN: Synchronous 4-Bit Counter; Published: 8-Jun-2000; LatestRevisionDate: 04-Mar-2005; LatestRevisionNote: Stylized 3D Model Added.; DatasheetVersion: Mar-1988; PackageVersion: Oct-1995; PackageReference: N016; Publisher: Altium Limited; PackageDescription: DIP; 16 Leads; Row Spacing 7.62 mm; Pitch 2.54 mm; Code_JEDEC: MS-001-BB; ComponentLink1Description: Manufacturer Link; ComponentLink1URL: http://www.ti.com/; ComponentLink2Description: Datasheet; ComponentLink2URL: http://www-s.ti.com/sc/ds/sn74ls161a.pdf; ComponentLink3Description: URL Link1; ComponentLink3URL: http://focus.ti.com/docs/prod/folders/print/sn74ls161a.html